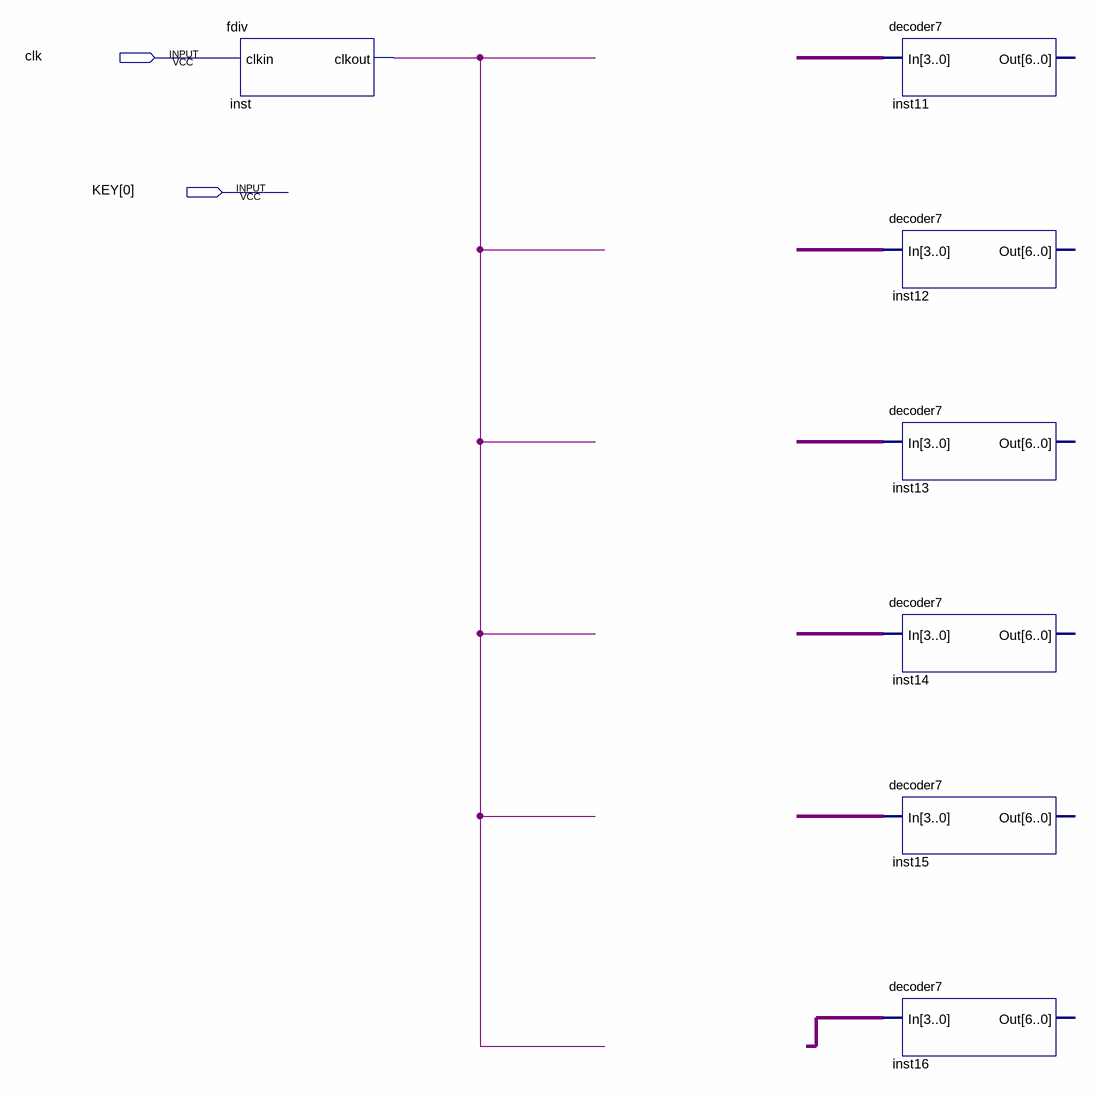
[diagram p0: schematic sheet]
// Quartus schematic cronometro.bdf as structural Verilog: 7 symbols, 2 pins
module cronometro (
  input  clk,
  input  [0:0] KEY
);

  wire inst_clkout;
  wire [3:0] undriven, undriven_2, undriven_3, undriven_4, undriven_5, undriven_6;

  fdiv inst (.clkin(clk), .clkout(inst_clkout));
  decoder7 inst11 (.In(undriven));  // open: Out
  decoder7 inst12 (.In(undriven_2));  // open: Out
  decoder7 inst13 (.In(undriven_3));  // open: Out
  decoder7 inst14 (.In(undriven_4));  // open: Out
  decoder7 inst15 (.In(undriven_5));  // open: Out
  decoder7 inst16 (.In(undriven_6));  // open: Out
endmodule
